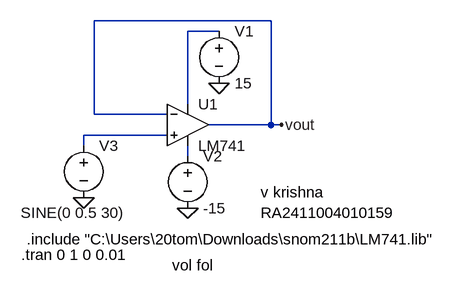
[diagram p0: schematic exp5-vol fol.asc]
exp5-vol fol.asc, the LTspice schematic file:
Version 4.1
SHEET 1 880 680
WIRE 336 -32 64 -32
WIRE 256 -16 208 -16
WIRE 208 96 208 -16
WIRE 64 112 64 -32
WIRE 176 112 64 112
WIRE 336 128 336 -32
WIRE 336 128 240 128
WIRE 352 128 336 128
WIRE 176 144 48 144
WIRE 48 160 48 144
WIRE 208 176 208 160
FLAG 256 64 0
FLAG 208 256 0
FLAG 352 128 vout
FLAG 48 240 0
SYMBOL OpAmps\\opamp2 208 64 R0
SYMATTR InstName U1
SYMATTR Value LM741
SYMBOL voltage 256 -32 R0
WINDOW 123 0 0 Left 0
WINDOW 39 0 0 Left 0
SYMATTR InstName V1
SYMATTR Value 15
SYMBOL voltage 208 160 R0
WINDOW 123 0 0 Left 0
WINDOW 39 0 0 Left 0
SYMATTR InstName V2
SYMATTR Value -15
SYMBOL voltage 48 144 R0
WINDOW 3 -97 119 Left 2
WINDOW 123 0 0 Left 0
WINDOW 39 0 0 Left 0
SYMATTR InstName V3
SYMATTR Value SINE(0 0.5 30)
TEXT -40 304 Left 2 !.include "C:\\Users\\20tom\\Downloads\\snom211b\\LM741.lib"
TEXT -48 328 Left 2 !.tran 0 1 0 0.01
TEXT 320 232 Left 2 !v krishna\nRA2411004010159
TEXT 184 344 Left 2 !vol fol

The netlist it stands for:
* exp5-vol fol.asc
X§U1 N002 vout N001 N003 vout LM741  ; pins In+ In- V+ V- OUT
V1 N001 0 15
V2 N003 0 -15
V3 N002 0 SINE(0 0.5 30)
.include "C:\Users\20tom\Downloads\snom211b\LM741.lib"
.tran 0 1 0 0.01
v krishna
RA2411004010159
vol fol
.backanno
.end